# EAGLE design SCK (EAGLE 9.2.2)
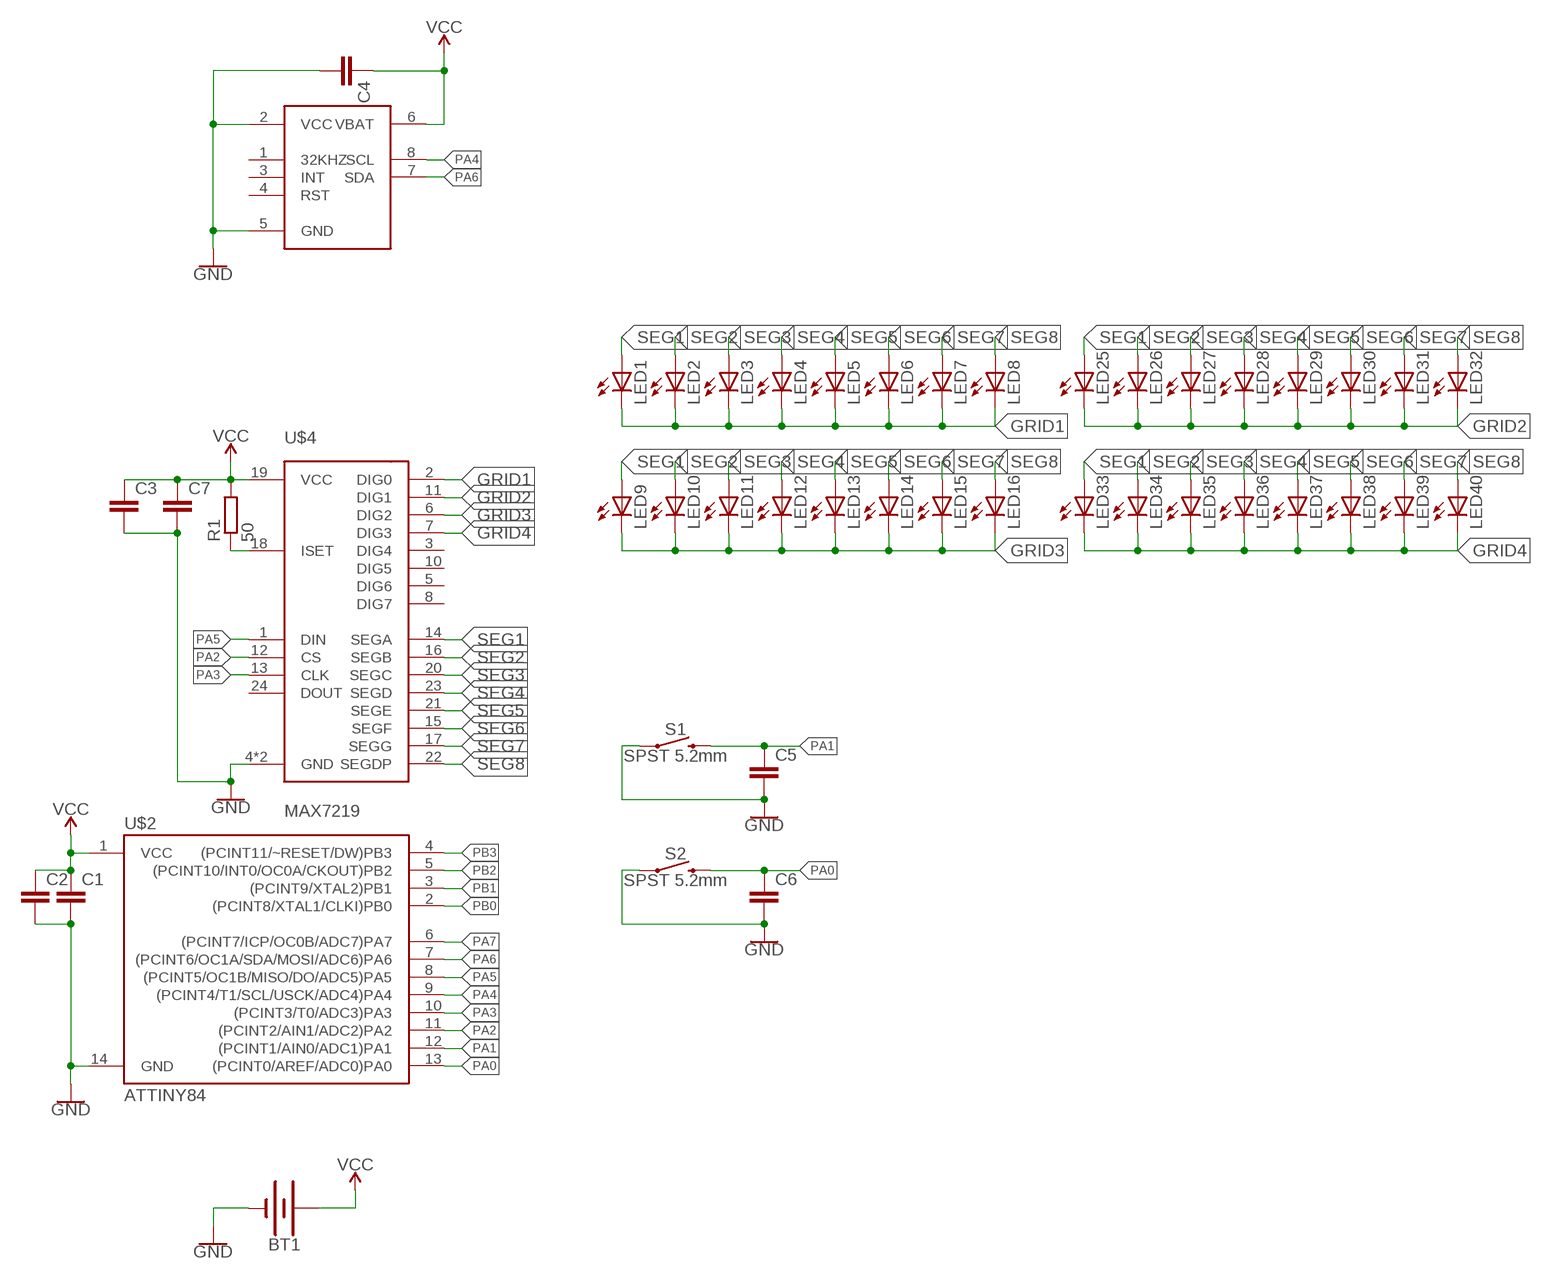
[diagram p0: schematic, sheet 1]

## Parts
BT1  BATTERY-20MM_SMD_4LEGS  [BATTCON_20MM_4LEGS]
C1  C-EUC0805  [C0805]
C2  C-EUC0805  [C0805]
C3  C-EUC0805  [C0805]
C4  C-EUC0805  [C0805]
C5  C-EUC0805  [C0805]
C6  C-EUC0805  [C0805]
C7  C-EUC0805  [C0805]
LED1  LEDCHIPLED_0805  [CHIPLED_0805]
LED2  LEDCHIPLED_0805  [CHIPLED_0805]
LED3  LEDCHIPLED_0805  [CHIPLED_0805]
LED4  LEDCHIPLED_0805  [CHIPLED_0805]
LED5  LEDCHIPLED_0805  [CHIPLED_0805]
LED6  LEDCHIPLED_0805  [CHIPLED_0805]
LED7  LEDCHIPLED_0805  [CHIPLED_0805]
LED8  LEDCHIPLED_0805  [CHIPLED_0805]
LED9  LEDCHIPLED_0805  [CHIPLED_0805]
LED10  LEDCHIPLED_0805  [CHIPLED_0805]
LED11  LEDCHIPLED_0805  [CHIPLED_0805]
LED12  LEDCHIPLED_0805  [CHIPLED_0805]
LED13  LEDCHIPLED_0805  [CHIPLED_0805]
LED14  LEDCHIPLED_0805  [CHIPLED_0805]
LED15  LEDCHIPLED_0805  [CHIPLED_0805]
LED16  LEDCHIPLED_0805  [CHIPLED_0805]
LED25  LEDCHIPLED_0805  [CHIPLED_0805]
LED26  LEDCHIPLED_0805  [CHIPLED_0805]
LED27  LEDCHIPLED_0805  [CHIPLED_0805]
LED28  LEDCHIPLED_0805  [CHIPLED_0805]
LED29  LEDCHIPLED_0805  [CHIPLED_0805]
LED30  LEDCHIPLED_0805  [CHIPLED_0805]
LED31  LEDCHIPLED_0805  [CHIPLED_0805]
LED32  LEDCHIPLED_0805  [CHIPLED_0805]
LED33  LEDCHIPLED_0805  [CHIPLED_0805]
LED34  LEDCHIPLED_0805  [CHIPLED_0805]
LED35  LEDCHIPLED_0805  [CHIPLED_0805]
LED36  LEDCHIPLED_0805  [CHIPLED_0805]
LED37  LEDCHIPLED_0805  [CHIPLED_0805]
LED38  LEDCHIPLED_0805  [CHIPLED_0805]
LED39  LEDCHIPLED_0805  [CHIPLED_0805]
LED40  LEDCHIPLED_0805  [CHIPLED_0805]
R1  50  R-EU_R0805  [R0805]
S1  SPST 5.2mm  MOMENTARY-SWITCH-SPST-SMD-4.6X2.8MM  [TACTILE_SWITCH_SMD_4.6X2.8MM]
S2  SPST 5.2mm  MOMENTARY-SWITCH-SPST-SMD-4.6X2.8MM  [TACTILE_SWITCH_SMD_4.6X2.8MM]
U$2  ATTINY84  [SOIC127P599X175-14]
U$3  DS3231M  [SOIC127P600X175-8]
U$4  MAX7219  [SOIC127P1032X265-24]

## Nets
GND: BT1.NEGATIVE(-) C1.2 C2.2 C3.2 C4.2 C5.2 C6.2 C7.2 S1.1 S1.2 S2.1 S2.2 U$2.14(GND) U$3.2(VCC) U$3.5(GND) U$4.4(GND) U$4.9(GND)
GRID1 [LED]: LED1.C LED2.C LED3.C LED4.C LED5.C LED6.C LED7.C LED8.C U$4.2(DIG0)
GRID2 [LED]: LED25.C LED26.C LED27.C LED28.C LED29.C LED30.C LED31.C LED32.C U$4.11(DIG1)
GRID3 [LED]: LED9.C LED10.C LED11.C LED12.C LED13.C LED14.C LED15.C LED16.C U$4.6(DIG2)
GRID4 [LED]: LED33.C LED34.C LED35.C LED36.C LED37.C LED38.C LED39.C LED40.C U$4.7(DIG3)
N$2: R1.1 U$4.18(ISET)
PA0: C6.1 S2.3 S2.4 U$2.13((PCINT0/AREF/ADC0)PA0)
PA1: C5.1 S1.3 S1.4 U$2.12((PCINT1/AIN0/ADC1)PA1)
PA2: U$2.11((PCINT2/AIN1/ADC2)PA2) U$4.12(CS)
PA3: U$2.10((PCINT3/T0/ADC3)PA3) U$4.13(CLK)
PA4: U$2.9((PCINT4/T1/SCL/USCK/ADC4)PA4) U$3.8(SCL)
PA5: U$2.8((PCINT5/OC1B/MISO/DO/ADC5)PA5) U$4.1(DIN)
PA6: U$2.7((PCINT6/OC1A/SDA/MOSI/ADC6)PA6) U$3.7(SDA)
PA7: U$2.6((PCINT7/ICP/OC0B/ADC7)PA7)
PB0: U$2.2((PCINT8/XTAL1/CLKI)PB0)
PB1: U$2.3((PCINT9/XTAL2)PB1)
PB2: U$2.5((PCINT10/INT0/OC0A/CKOUT)PB2)
PB3: U$2.4((PCINT11/~RESET/DW)PB3)
SEG1 [LED]: LED1.A LED9.A LED25.A LED33.A U$4.14(SEGA)
SEG2 [LED]: LED2.A LED10.A LED26.A LED34.A U$4.16(SEGB)
SEG3 [LED]: LED3.A LED11.A LED27.A LED35.A U$4.20(SEGC)
SEG4 [LED]: LED4.A LED12.A LED28.A LED36.A U$4.23(SEGD)
SEG5 [LED]: LED5.A LED13.A LED29.A LED37.A U$4.21(SEGE)
SEG6 [LED]: LED6.A LED14.A LED30.A LED38.A U$4.15(SEGF)
SEG7 [LED]: LED7.A LED15.A LED31.A LED39.A U$4.17(SEGG)
SEG8 [LED]: LED8.A LED16.A LED32.A LED40.A U$4.22(SEGDP)
VCC [PWR]: BT1.POSITIVE@1(+) BT1.POSITIVE@2(+) BT1.POSITIVE@3(+) BT1.POSITIVE@4(+) C1.1 C2.1 C3.1 C4.1 C7.1 R1.2 U$2.1(VCC) U$3.6(VBAT) U$4.19(VCC)
Unconnected: U$3.1(32KHZ) U$3.3(INT) U$3.4(RST) U$4.3(DIG4) U$4.5(DIG6) U$4.8(DIG7) U$4.10(DIG5) U$4.24(DOUT)

## Library data of the parts
BT1 = SparkFun-Batteries:BATTERY: Battery - Single Cell A variety of battery chemistries, sizes, and footprints. Device List: 20MM_PTH - Coin Cell Battery Holder - 20mm (PTH) <https://www.sparkfun.com/products/783> 6.8MM_PTH - Coin Cell Battery Holder - 6.8MM(SMD) <https://www.digikey.com/product-detail/en/seiko-instruments/MS621FE-FL11E/728-1057-ND/1889208?WT.srch=1&gclid=CNOQ5a6LzdQCFZS2wAodXCkE0g> 12MM_SMD - Coin Cell Battery Holder - 12mm (SMD) <https://www.sparkfun.com/products/10592> 12MM_PTH - Coin Cell Battery Holder - 12mm (PTH) <https://www.sparkfun.com/products/7948> 20MM_SMD - 20mm Coin Cell Battery Holder (SMD) (2 legs) Used on the Big Time Watch Kit <https://www.sparkfun.com/products/11734> 20MM_SMD_4LEGS - Coin Cell Battery Holder - 20mm (SMD) <https://www.sparkfun.com/products/11892> 20MM_SMD_4LEGS_OVERPASTE - Coin Cell Battery Holder - 20mm (SMD) <https://www.sparkfun.com/products/11892> (Over-paste on the legs) 24.5MM_PTH - Coin Cell Battery Holder - 24.5mm (PTH) <https://www.sparkfun.com/products/8863> 9V - 9V Battery Holder - PC Mount Used on the SparkFun SparkPunk Sound Kit <https://www.sparkfun.com/products/11177> and SparkFun SparkPunk Sequencer Kit <https://www.sparkfun.com/products/12707> 18650 - Battery Holder - 18650 (PTH) <https://www.sparkfun.com/products/13113> AA - Battery Holder - 1xAA (PTH) <https://www.sparkfun.com/products/7949> AAA - Battery Holder - 1xAAA (PTH) <https://www.sparkfun.com/products/12718> AA_KIT - Battery Holder - 1xAA (PTH) <https://www.sparkfun.com/products/7949> Special kit package - pads only have exposed copper on one side of the board. AAA_KIT - Battery Holder - 1xAAA (PTH) <https://www.sparkfun.com/products/12718> Special kit package - pads only have exposed copper on one side of the board.; PROD_ID: BATT-10373; SF_SKU: PRT-11892
C1-C7 = resistor:C-EU: CAPACITOR, European symbol
LED1-LED16 LED25-LED40 = led:LED: LED OSRAM: - CHIPLED LG R971, LG N971, LY N971, LG Q971, LY Q971, LO R971, LY R971 LH N974, LH R974 LS Q976, LO Q976, LY Q976 LO Q996 - Hyper CHIPLED LW Q18S LB Q993, LB Q99A, LB R99A - SideLED LS A670, LO A670, LY A670, LG A670, LP A670 LB A673, LV A673, LT A673, LW A673 LH A674 LY A675 LS A676, LA A676, LO A676, LY A676, LW A676 LS A679, LY A679, LG A679 - Hyper Micro SIDELED® LS Y876, LA Y876, LO Y876, LY Y876 LT Y87S - SmartLED LW L88C, LW L88S LB L89C, LB L89S, LG L890 LS L89K, LO L89K, LY L89K LS L896, LA L896, LO L896, LY L896 - TOPLED LS T670, LO T670, LY T670, LG T670, LP T670 LSG T670, LSP T670, LSY T670, LOP T670, LYG T670 LG T671, LOG T671, LSG T671 LB T673, LV T673, LT T673, LW T673 LH T674 LS T676, LA T676, LO T676, LY T676, LB T676, LH T676, LSB T676, LW T676 LB T67C, LV T67C, LT T67C, LS T67K, LO T67K, LY T67K, LW E67C LS E67B, LA E67B, LO E67B, LY E67B, LB E67C, LV E67C, LT E67C LW T67C LS T679, LY T679, LG T679 LS T770, LO T770, LY T770, LG T770, LP T770 LB T773, LV T773, LT T773, LW T773 LH T774 LS E675, LA E675, LY E675, LS T675 LS T776, LA T776, LO T776, LY T776, LB T776 LHGB T686 LT T68C, LB T68C - Hyper Mini TOPLED® LB M676 - Mini TOPLED Santana® LG M470 LS M47K, LO M47K, LY M47K Source: http://www.osram.convergy.de LUXEON: - LUMILED® LXK2-PW12-R00, LXK2-PW12-S00, LXK2-PW14-U00, LXK2-PW14-V00 LXK2-PM12-R00, LXK2-PM12-S00, LXK2-PM14-U00 LXK2-PE12-Q00, LXK2-PE12-R00, LXK2-PE12-S00, LXK2-PE14-T00, LXK2-PE14-U00 LXK2-PB12-K00, LXK2-PB12-L00, LXK2-PB12-M00, LXK2-PB14-N00, LXK2-PB14-P00, LXK2-PB14-Q00 LXK2-PR12-L00, LXK2-PR12-M00, LXK2-PR14-Q00, LXK2-PR14-R00 LXK2-PD12-Q00, LXK2-PD12-R00, LXK2-PD12-S00 LXK2-PH12-R00, LXK2-PH12-S00 LXK2-PL12-P00, LXK2-PL12-Q00, LXK2-PL12-R00 Source: www.luxeon.com KINGBRIGHT: KA-3528ASYC Source: www.kingbright.com
R1 = resistor:R-EU_: RESISTOR, European symbol
S1 S2 = SparkFun-Switches:MOMENTARY-SWITCH-SPST: Momentary Switch (Pushbutton) - SPST Normally-open (NO) SPST momentary switches (buttons, pushbuttons). Variants PTH-12MM - 12mm square, through-hole Momentary Pushbutton Switch - 12mm Square <https://www.sparkfun.com/products/9190> (COM-09190) PTH-6.0MM, PTH-6.0MM-KIT - 6.0mm square, through-hole Mini Pushbutton Switch <https://www.sparkfun.com/products/97> (COM-00097) KIT package intended for soldering kit's - only one side of pads' copper is exposed. PTH-RIGHT-ANGLE-KIT - Right-angle, through-hole Right Angle Tactile Button <https://www.sparkfun.com/products/10791> - Used on SparkFun BigTime Watch Kit <https://www.sparkfun.com/products/11734> SMD-12MM - 12mm square, surface-mount Tactile Button - SMD (12mm) <https://www.sparkfun.com/products/12993> (COM-12993) Used on SparkFun PicoBoard <https://www.sparkfun.com/products/11888> SMD-4.5MM - 4.5mm Square Trackball Switch Used on SparkFun Blackberry Trackballer Breakout <https://www.sparkfun.com/products/13169> SMD-4.6MMX2.8MM - 4.60mm x 2.80mm, surface mount Used on SparkFun SAMD21 Mini Breakout <https://www.sparkfun.com/products/13664> SMD-5.2MM, SMD-5.2-REDUNDANT - 5.2mm square, surface-mount Mini Pushbutton Switch - SMD <https://www.sparkfun.com/products/8720> (COM-08720) Used on Arduino Pro Mini <https://www.sparkfun.com/products/11114> REDUNDANT package connects both switch circuits together SMD-6.0X3.5MM - 6.0 x 3.5mm, surface mount Momentary Reset Switch SMD <https://www.sparkfun.com/products/8229> (COM-08229) SMD-6.2MM-TALL - 6.2mm square, surface mount Tactile Button - SMD (6mm) <https://www.sparkfun.com/products/12992> Used on SparkFun Digital Sandbox <https://www.sparkfun.com/products/12651> SMD-RIGHT-ANGLE - Right-angle, surface mount Used on SparkFun Block for Intel® Edison - Arduino <https://www.sparkfun.com/products/13036>; PROD_ID: SWCH-13065
U$2 = SCK_custom:ATTINY84
U$3 = SCK_custom:DS3231M
U$4 = SCK_custom:MAX7219

## Net classes
0 default: width 0.2 mm
1 PWR: width 0.4 mm
2 LED: width 0.3 mm

## Board
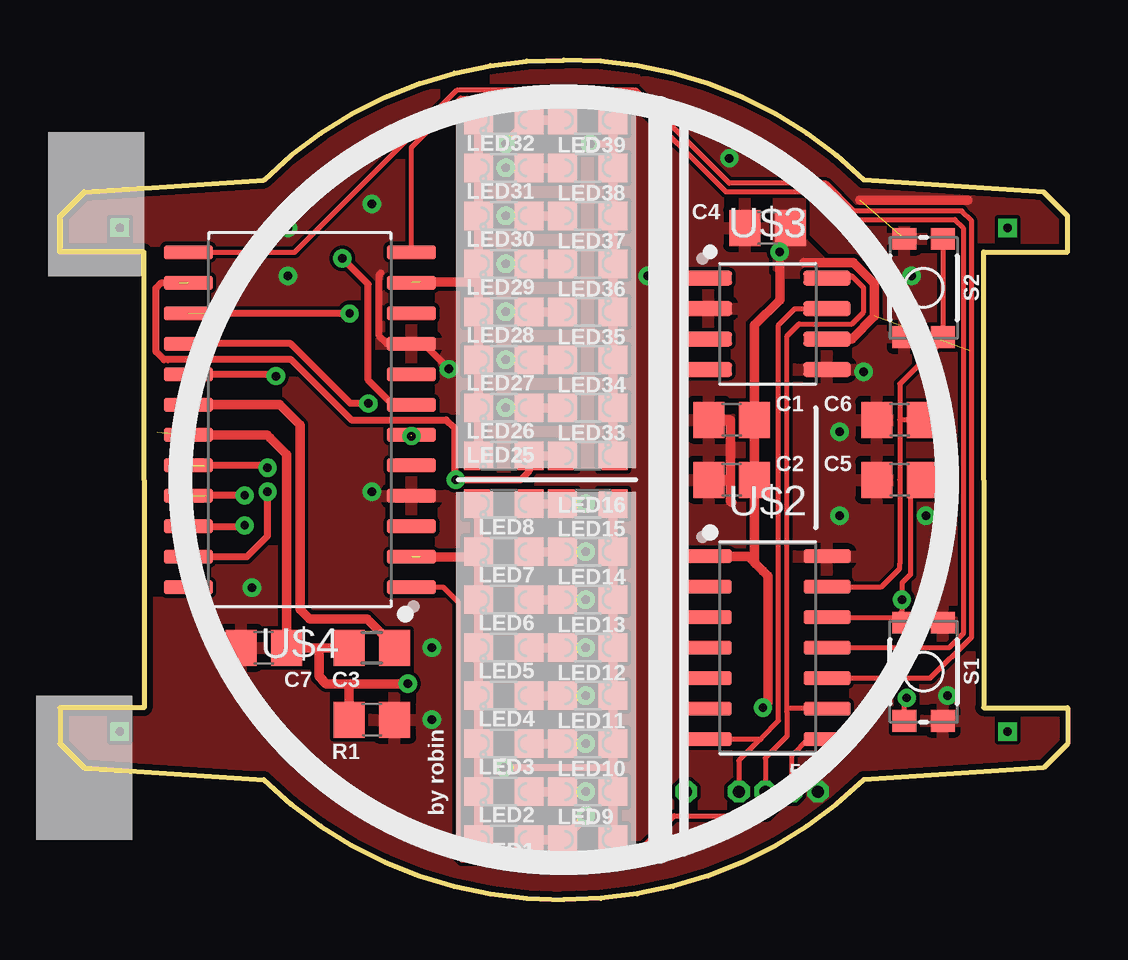
[diagram p1: board, top side]
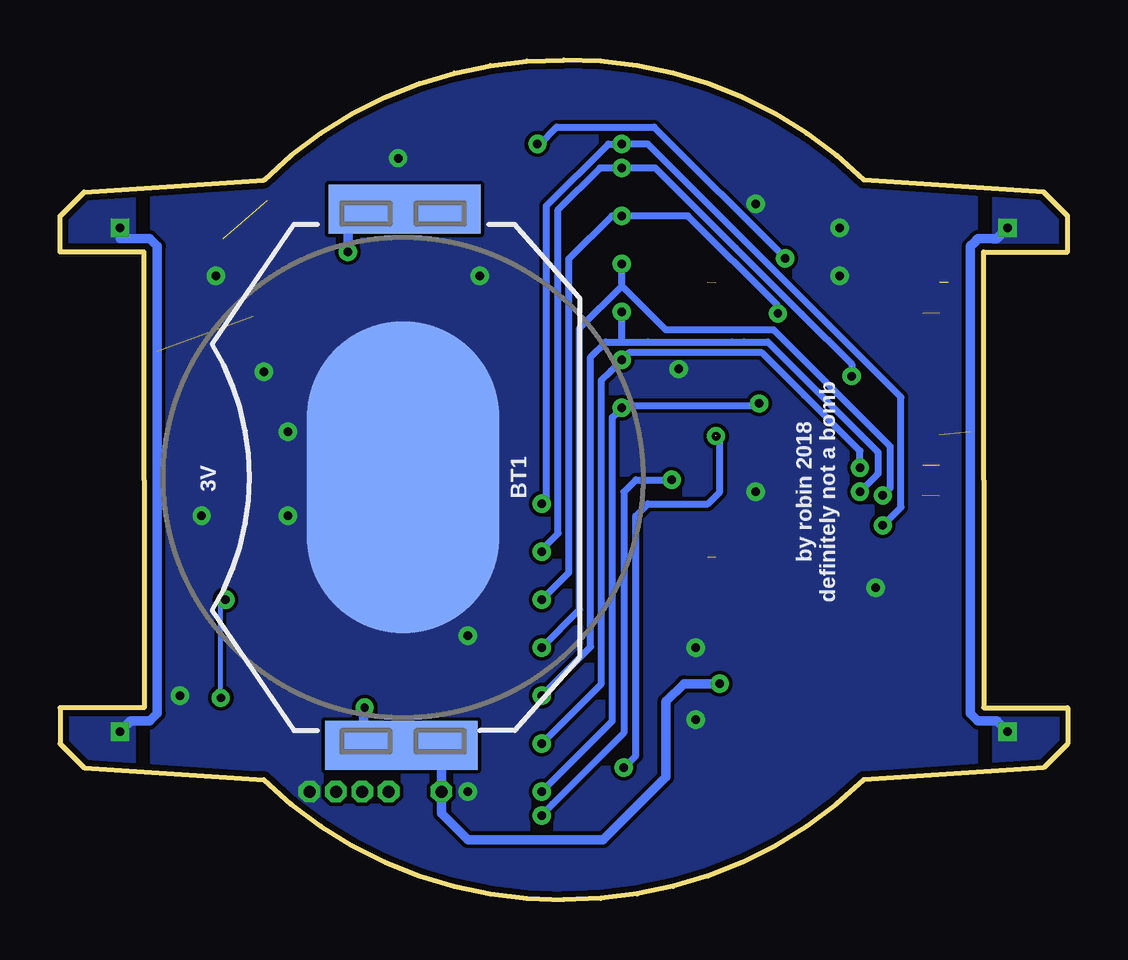
[diagram p2: board, bottom side, seen from below]

Size 42 x 35 mm. Coordinates in mm from the lower left corner, seen from the top.
Outline: 38.5,17.5 38.5,8 42,8 42,6.5 41,5.5 33.5,5 arc-45 21,0 arc-45 8.5,5 1,5.5 0,6.5 0,8 3.5,8 3.5,17.5 3.5,27 0,27 0,28.5 1,29.5 8.5,30 arc-45 21,35 arc-45 33.5,30 41,29.5 42,28.5 42,27 38.5,27 38.5,17.5
Copper layers (1*16): Top 0.035mm / dielectric 1.5mm / Bottom 0.035mm
Design rules "default *": minimum track width 6mil, minimum drill 0.35mm, track to track 6mil, track to pad 6mil, pad to pad 6mil, via to via 6mil, smd to smd 6mil, copper to edge 10mil, drill to drill 6mil, minimum pad ring 10mil, minimum via ring 8mil, stop-mask expansion 4mil, vias tented up to drill 0.39mm, thermal gap 10mil

### Footprints (pad centres in the part's own frame; a part is rotated, then mirrored left to right if it is on the bottom)
BATTCON_20MM_4LEGS = smd 13 x 8: NEGATIVE 0,0 | smd 2.032 x 3.175: POSITIVE@1 -11.176,1.651; POSITIVE@2 -11.176,-1.524; POSITIVE@3 11.176,1.524; POSITIVE@4 11.176,-1.651
C0805 = smd 1.3 x 1.5: 1 -0.95,0; 2 0.95,0
CHIPLED_0805 = smd 1.2 x 1.2: A 0,-1.05; C 0,1.05
R0805 = smd 1.3 x 1.5: 1 -0.95,0; 2 0.95,0
TACTILE_SWITCH_SMD_4.6X2.8MM = smd 0.9 x 1: 1 -2.05,-0.8; 2 2.05,-0.8; 3 2.05,0.8; 4 -2.05,0.8
SOIC127P599X175-14 = smd 1.967 x 0.594: 1 -2.469,3.81; 2 -2.469,2.54; 3 -2.469,1.27; 4 -2.469,0; 5 -2.469,-1.27; 6 -2.469,-2.54; 7 -2.469,-3.81; 8 2.469,-3.81; 9 2.469,-2.54; 10 2.469,-1.27; 11 2.469,0; 12 2.469,1.27; 13 2.469,2.54; 14 2.469,3.81
SOIC127P600X175-8 = smd 1.968 x 0.602: 1 -2.473,1.905; 2 -2.473,0.635; 3 -2.473,-0.635; 4 -2.473,-1.905; 5 2.473,-1.905; 6 2.473,-0.635; 7 2.473,0.635; 8 2.473,1.905
SOIC127P1032X265-24 = smd 2.052 x 0.589: 1 -4.654,6.985; 2 -4.654,5.715; 3 -4.654,4.445; 4 -4.654,3.175; 5 -4.654,1.905; 6 -4.654,0.635; 7 -4.654,-0.635; 8 -4.654,-1.905; 9 -4.654,-3.175; 10 -4.654,-4.445; 11 -4.654,-5.715; 12 -4.654,-6.985; 13 4.654,-6.985; 14 4.654,-5.715; 15 4.654,-4.445; 16 4.654,-3.175; 17 4.654,-1.905; 18 4.654,-0.635; 19 4.654,0.635; 20 4.654,1.905; 21 4.654,3.175; 22 4.654,4.445; 23 4.654,5.715; 24 4.654,6.985

### Placement (x,y rotation side)
BT1  27.7,17.6 270 bottom
C1  28,20 180 top
C2  28,17.5 180 top
C3  13,7.5 0 top
C4  29.5,28 180 top
C5  35,17.5 180 top
C6  35,20 180 top
C7  8.5,10.5 180 top
LED1  18.5,2.5 90 top
LED2  18.5,4.5 90 top
LED3  18.5,6.5 90 top
LED4  18.5,8.5 90 top
LED5  18.5,10.5 90 top
LED6  18.5,12.5 90 top
LED7  18.5,14.5 90 top
LED8  18.5,16.5 90 top
LED9  22,2.5 270 top
LED10  22,4.5 270 top
LED11  22,6.5 270 top
LED12  22,8.5 270 top
LED13  22,10.5 270 top
LED14  22,12.5 270 top
LED15  22,14.5 270 top
LED16  22,16.5 270 top
LED25  18.5,18.5 90 top
LED26  18.5,20.5 90 top
LED27  18.5,22.5 90 top
LED28  18.5,24.5 90 top
LED29  18.5,26.5 90 top
LED30  18.5,28.5 90 top
LED31  18.5,30.5 90 top
LED32  18.5,32.5 90 top
LED33  22,18.5 270 top
LED34  22,20.5 270 top
LED35  22,22.5 270 top
LED36  22,24.5 270 top
LED37  22,26.5 270 top
LED38  22,28.5 270 top
LED39  22,30.5 270 top
LED40  22,32.5 270 top
R1  13,10.5 180 top
S1  36,9.5 90 top
S2  36,25.5 270 top
U$2  29.5,10.5 0 top
U$3  29.5,24 0 top
U$4  10,20 180 top

### Tracks (layer width: path | path; a pad name or v marks a point on that pad's centre or on a via)
GND  (via drill 0.35, 0.5)  (1 unrouted)
  Top 0.3: v16.21,22.12 15.15,23.18 U$4.9 13.62,23.18 13.3,23.5 13.3,26.04 13.38,26.12
  Top 0.4: 28,16.55 27.95,16.6 27.95,17.5 | 27.95,17.5 27.95,20 C1.2 | C2.2 27.95,17.5 | 33.35,29.15 37.85,29.15
  other vias: 13,17 9.5,26 13,29 8,13 33.5,22 24.5,26 15.5,7.5 32.5,16 32.5,19.5 25,11 31.6,4.5 36.1,16 25,4.5 15.5,10.5 37,8.5 35.5,26 9.5,28 27.9,30.9
  pour Bottom (rank 6, no thermals): 4,-2 38,-2 38,38 4,38
  pour Top (rank 6): -2,-3.5 44,-3.5 44,39 -2,39
GRID1  (1 unrouted)
  Top 0.4: LED8.C LED7.C | LED7.C LED6.C LED5.C LED4.C LED3.C LED2.C LED1.C | LED7.C 17.23,14.29 15,14.29
GRID2  (1 unrouted)
  Top 0.4: LED32.C LED31.C LED30.C LED29.C 17.45,25.75 | 17.45,25.75 17.45,25.5 LED28.C LED27.C LED26.C LED25.C | 15.01,25.75 17.45,25.75
GRID3  (via drill 0.35)  (1 unrouted)
  Top 0.3: v18.5,5.5 23,5.5 23.05,5.5
  Top 0.4: LED9.C LED10.C 23.05,5.5 LED11.C LED12.C LED13.C LED14.C LED15.C LED16.C
  Bottom 0.3: v18.5,5.5 18,6 18,16 17.5,16.5 15,16.5 14.5,17 14.5,19.17 v14.65,19.32
GRID4  (via drill 0.35)
  Top 0.3: v11.77,26.73 12.85,25.65 12.85,21.65 13.86,20.64 U$4.7 | 23.05,31.5 v22.1,31.5
  Top 0.4: LED33.C LED34.C LED35.C LED36.C LED37.C LED38.C LED39.C 23.05,31.5 LED40.C
  Bottom 0.3: v11.77,26.73 17.24,32.2 21.3,32.2 22,31.5 v22.1,31.5
N$2
  Top 0.4: R1.1 13.95,10.55 12.8,11.7 10.4,11.7 10,12.1 10,19.78 9.15,20.64 U$4.18
PA0
  Top 0.2: C6.1 35,20 | S2.4 S2.3 36.8,23.3 35,21.5 35,20 | 35,20 35,17.5 35,14 35,13.8 34.24,13.04 U$2.13
PA1  (via drill 0.35)
  Top 0.2: 35.95,16.95 C5.1 35.45,17 35.45,13.55 35.1,13.2 v35.1,12.5 35.1,12 | 35.1,12 35.1,11.65 35.12,11.62 | 35.12,11.62 S1.3 | 35.12,11.63 35.12,11.62 | S1.4 35.2,8.31 v35.3,8.41 | U$2.12 34.87,11.77 35.1,12
  Bottom 0.2: v35.3,8.41 35.3,12.3 v35.1,12.5
PA2
  Top 0.2: U$4.12 14.65,31.35 16.7,33.41 23.85,33.41 27.63,29.63 27.75,29.5 31,29.5 31.8,29.5 32.95,28.35 37.31,28.35 37.65,28.01 37.65,11.09 37.06,10.5 U$2.11
PA3
  Top 0.2: U$4.13 9.79,26.98 16.56,33.76 24,33.76 27.9,29.85 31.95,29.85 33.1,28.7 37.6,28.7 38,28.3 38,10.95 36.28,9.23 U$2.10
PA4  (via drill 0.5)
  Top 0.2: v29.4,4.5 29.4,5.9 30.3,6.81 30.3,7.8 30.3,8 | U$3.8 32.91,25.91 33,26 33.5,25.5 33.5,24.5 33,24 30.8,24 30.3,23.5 30.3,8 | U$2.9 30.34,7.96 30.3,8
PA5  (via drill 0.5)
  Top 0.2: U$4.1 15.98,13.02 16.6,12.4 16.6,1.79 16.75,1.65 23.75,1.65 25.61,3.5 29.49,3.5 30.45,4.46 v30.5,4.5 30.5,5.5 30.5,6 31.19,6.69 U$2.8
PA6  (via drill 0.5)
  Top 0.2: 29.25,6.75 29.05,6.55 28.3,5.8 v28.3,4.5 | 29.25,6.75 29.95,7.45 29.95,23.95 30.63,24.64 U$3.7 | U$2.7 29.19,6.69 29.25,6.75
SEG1  (via drill 0.35)  (1 unrouted)
  Top 0.3: LED25.A 19.55,17.85 19.2,17.5 v16.5,17.5 16.45,17.5 16.45,19.65 16.1,20 12.15,20 9.64,22.51 4.51,22.51 4.5,22.5 4.34,22.5 4,22.84 4,25.5 4.22,25.71 4.96,25.71
  Top 0.4: LED1.A LED9.A 21.92,3.47 v21.92,3.5 | LED25.A LED33.A
  Bottom 0.3: v16.5,17.5 18,17.5 18.5,17 18.5,6.96 21.48,3.98 21.92,3.54 v21.92,3.5
SEG2  (via drill 0.35)
  Top 0.3: v12.86,20.68 12.11,20.68 9.62,23.18 U$4.16
  Top 0.4: LED2.A LED10.A v21.92,4.5 | LED34.A LED26.A v18.58,20.5
  Bottom 0.3: v21.92,4.5 18.98,7.44 18.98,20.1 v18.58,20.5 18.48,20.6 12.94,20.6 v12.86,20.68
SEG3  (via drill 0.35)  (1 unrouted)
  Top 0.3: 6.03,18.1 8.55,18.1 v8.65,18
  Top 0.4: LED3.A LED11.A v21.92,6.5 | LED35.A LED27.A v18.58,22.5
  Bottom 0.3: v8.65,18 8.65,18.7 10.97,21.02 12.75,22.8 18.28,22.8 v18.58,22.5 19.04,22.04 19.43,21.65 19.43,8.99 v21.92,6.5
SEG4  (via drill 0.35)
  Top 0.3: v8.65,17 8.65,15.15 7.79,14.29 U$4.23 | LED28.A v18.58,24.5
  Top 0.4: LED4.A LED12.A v21.92,8.5 | LED36.A LED28.A
  Bottom 0.3: v21.92,8.5 19.88,10.54 19.88,22.62 19.25,23.25 18.5,23.25 | v8.65,17 7.9,17.75 7.9,18.65 12.5,23.25 13.5,23.25 14,23.25 17.5,23.25 18.5,23.25 | 18.5,23.25 18.58,23.33 v18.58,24.5
SEG5  (via drill 0.35)  (1 unrouted)
  Top 0.3: v7.7,16.85 6.05,16.85
  Top 0.4: LED5.A LED13.A v21.92,10.5 | LED37.A LED29.A v18.58,26.5
  Bottom 0.3: v21.92,10.5 20.33,12.09 20.33,23.83 18.58,25.58 | v7.7,16.85 7.4,17.15 7.4,18.9 12.25,23.75 16.5,23.75 16.75,23.75 18.58,25.58 | 18.58,25.58 v18.58,26.5
SEG6  (via drill 0.35)  (1 unrouted)
  Top 0.3: v12.07,24.43 6.04,24.43
  Top 0.4: LED6.A LED14.A v21.92,12.5 | LED38.A LED30.A v18.58,28.5
  Bottom 0.3: 18.75,28.5 v18.58,28.5 | 18.75,28.5 19,28.5 20.79,26.71 20.79,14.67 20.79,13.63 v21.92,12.5 | v12.07,24.43 12.07,24.75 15.82,28.5 18.75,28.5
SEG7  (via drill 0.35)
  Top 0.3: v9,21.82 8.91,21.91 U$4.17
  Top 0.4: LED7.A LED15.A v21.92,14.5 | LED39.A LED31.A v18.58,30.5
  Bottom 0.3: v21.92,14.5 21.92,14.58 21.24,15.26 21.24,28.76 19.5,30.5 v18.58,30.5 18.5,30.5 17.18,30.5 13.84,27.16 11.09,24.41 9,22.32 v9,21.82
SEG8  (via drill 0.35)
  Top 0.3: LED16.A v21.92,16.5 | v7.7,15.6 7.65,15.55 U$4.22
  Top 0.4: LED16.A LED8.A | LED40.A 20.5,32.5 LED32.A 18.58,31.53 v18.58,31.5
  Bottom 0.3: v7.7,15.6 6.95,16.35 6.95,20.95 17.5,31.5 v18.58,31.5 19.14,31.5 21.72,28.92 21.72,16.7 v21.92,16.5
VCC  (via drill 0.35, 0.5)  (2 unrouted)
  Top 0.4: C2.1 C1.1 28.95,22.59 28.95,23.95 30,25 30,26.5 | C7.1 10.7,10.5 | 10.7,10.5 11,10.5 R1.2 12.25,10.5 | C7.1 9.45,18.55 8.75,19.25 | 8.63,19.36 8.75,19.25 | 29,14 29.3,13.7 29.5,13.5 29.5,10.8 29.5,8.2 v29.3,8 | C2.1 28.82,17.38 | 10.7,10.5 10.8,10.4 10.8,9.3 11.1,9 12,9 | v14.5,9 12,9 | C2.1 28.95,14.05 29,14 | C3.1 12.05,8.95 12,9 | 2.52,7.01 v2.5,7 | 9.39,10.36 C7.1 | U$3.6 33.01,23.36 33.95,24.31 33.95,25.69 33.08,26.56 31,26.56 | U$4.19 8.63,19.36 | 8.63,19.36 8.75,19.25 | U$2.1 28.69,14.31 29,14
  Bottom 0.4: 29.9,28.1 29.75,28.25 | 29.75,28.25 29.5,28.5 29.25,28.75 BT1.POSITIVE@2 | BT1.POSITIVE@2 29,29 28,29 | 28,29 26.25,29 BT1.POSITIVE@1 | 28,29 BT1.POSITIVE@2 | v14.5,9 16,9 16.75,8.25 16.75,5.11 19.36,2.5 25,2.5 26.1,3.6 v26.1,4.5 26.1,6.35 BT1.POSITIVE@3 | 29.75,28.25 30,28 30,27.5 v30,27 | v39.5,7 39.05,7.45 38.27,7.45 37.95,7.77 37.95,22.87 37.95,27.23 38.27,27.55 39.5,27.55 v39.5,28 | v2.5,7 2.95,7.45 3.73,7.45 4.05,7.77 4.05,19.5 4.05,27.23 3.89,27.39 3.73,27.55 2.95,27.55 v2.5,28 | BT1.POSITIVE@3 26,6.42 25.7,6.12 | v29.3,8 29.35,7.95 BT1.POSITIVE@4 29.22,6.57 26.31,6.57 BT1.POSITIVE@3 | 30.36,28.24 30.19,28.07 BT1.POSITIVE@2
  pour Bottom (no thermals): 39,-2 43,-2 43,38 39,38
  pour Bottom (no thermals): -1,-2 3,-2 3,38 -1,38
  pour Top (no thermals): 29.8,29.2 29.8,26.3 30.1,26 31.1,26 31.8,26.7 31,27.5 31,28 31,29.2

### Text on the board
tNames: 5 | by robin
bNames: by robin 2018 / definitely not a bomb | 3V
tStop: SCK
_tNames: LED1 | LED2 | LED3 | LED4 | LED5 | LED6 | LED7 | LED8 | LED25 | LED26 | LED27 | LED28 | LED29 | LED30 | LED31 | LED32 | LED9 | LED10 | LED11 | LED12 | LED13 | LED14 | LED15 | LED16 | LED33 | LED34 | LED35 | LED36 | LED37 | LED38 | LED39 | LED40 | C2 | C1 | U$1 | RTC1 | C5 | C6 | C4 | S1 | S2
_bNames: C3 | U1